# EAGLE design iotssb (EAGLE 9.2.2)

## Sheet 1 of 7
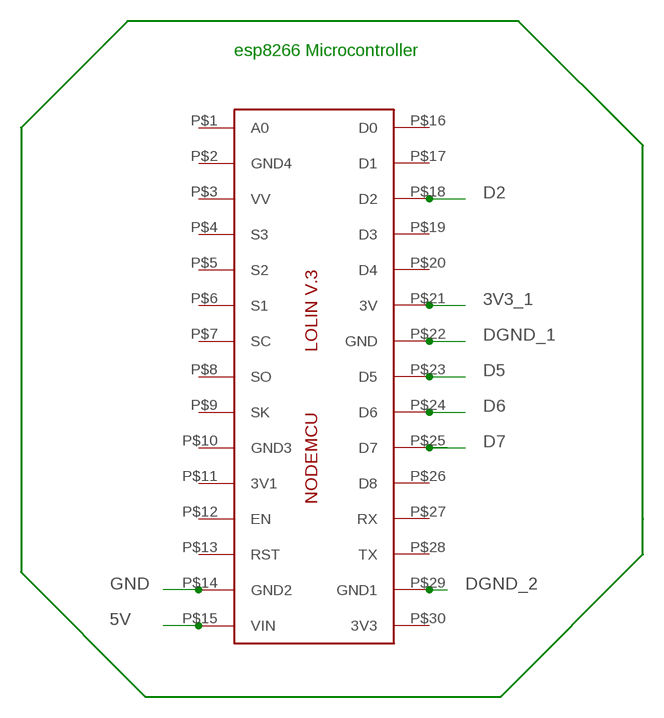
[diagram p0: schematic, sheet 1]

### Parts
IC2  LOLINV3ESP12E  [LOL1NV0.1]

### Nets
3V3_1: IC2.P$21(3V) ; also sheet 2
5V: IC2.P$15(VIN) ; also sheet 3
D2: IC2.P$18(D2) ; also sheet 2
D5: IC2.P$23(D5) ; also sheet 4
D6: IC2.P$24(D6) ; also sheet 5
D7: IC2.P$25(D7) ; also sheet 6
DGND_1: IC2.P$22(GND) ; also sheet 2
DGND_2: IC2.P$29(GND1) ; also sheet 4,5,6
GND: IC2.P$14(GND2) ; also sheet 2,3
Unconnected: IC2.P$1(A0) IC2.P$2(GND4) IC2.P$3(VV) IC2.P$4(S3) IC2.P$5(S2) IC2.P$6(S1) IC2.P$7(SC) IC2.P$8(SO) IC2.P$9(SK) IC2.P$10(GND3) IC2.P$11(3V1) IC2.P$12(EN) IC2.P$13(RST) IC2.P$16(D0) IC2.P$17(D1) IC2.P$19(D3) IC2.P$20(D4) IC2.P$26(D8) IC2.P$27(RX) IC2.P$28(TX) IC2.P$30(3V3)

### Notes on the sheet
- esp8266 Microcontroller

## Sheet 2 of 7
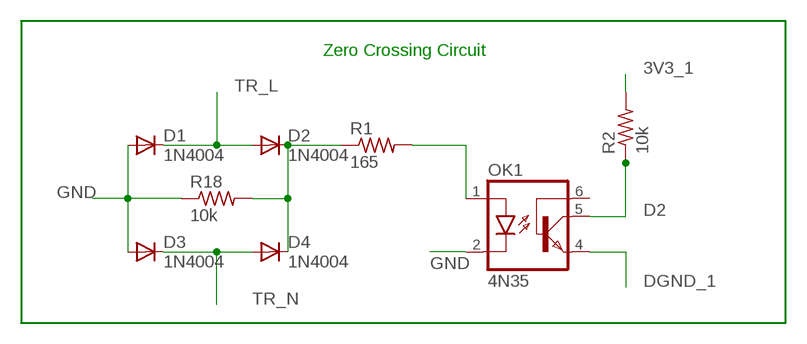
[diagram p1: schematic, sheet 2]

### Parts
D1  1N4004  [DO41-10]
D2  1N4004  [DO41-10]
D3  1N4004  [DO41-10]
D4  1N4004  [DO41-10]
OK1  4N35  [DIL06]
R1  165  R-US_0207/10  [0207/10]
R2  10k  R-US_0207/10  [0207/10]
R18  10k  R-US_0207/10  [0207/10]

### Nets
3V3_1: R2.2 ; also sheet 1
D2: OK1.5(COL) R2.1 ; also sheet 1
DGND_1: OK1.4(EMI) ; also sheet 1
GND: D1.A D3.A OK1.2(C) R18.1 ; also sheet 1,3
N$1: D2.C D4.C R1.1 R18.2
N$5: OK1.1(A) R1.2
TR_L: D1.C D2.A ; also sheet 3,7
TR_N: D3.C D4.A ; also sheet 3,7
Unconnected: OK1.6(BAS)

### Notes on the sheet
- Zero Crossing Circuit

## Sheet 3 of 7
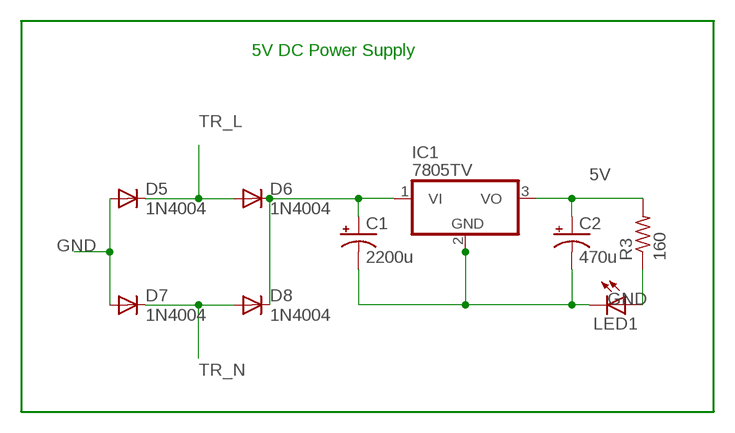
[diagram p2: schematic, sheet 3]

### Parts
C1  2200u  CPOL-USE7.5-18  [E7,5-18]
C2  470u  CPOL-USE5-13  [E5-13]
D5  1N4004  [DO41-10]
D6  1N4004  [DO41-10]
D7  1N4004  [DO41-10]
D8  1N4004  [DO41-10]
IC1  7805TV  [TO220V]
LED1  LED3MM  [LED3MM]
R3  160  R-US_0207/10  [0207/10]

### Nets
5V: C2.+ IC1.3(VO) R3.2 ; also sheet 1
GND: C1.- C2.- D5.A D7.A IC1.2(GND) LED1.K(C) ; also sheet 1,2
N$2: C1.+ D6.C D8.C IC1.1(VI)
N$3: LED1.A R3.1
TR_L: D5.C D6.A ; also sheet 2,7
TR_N: D7.C D8.A ; also sheet 2,7

### Notes on the sheet
- 5V DC Power Supply

## Sheet 4 of 7
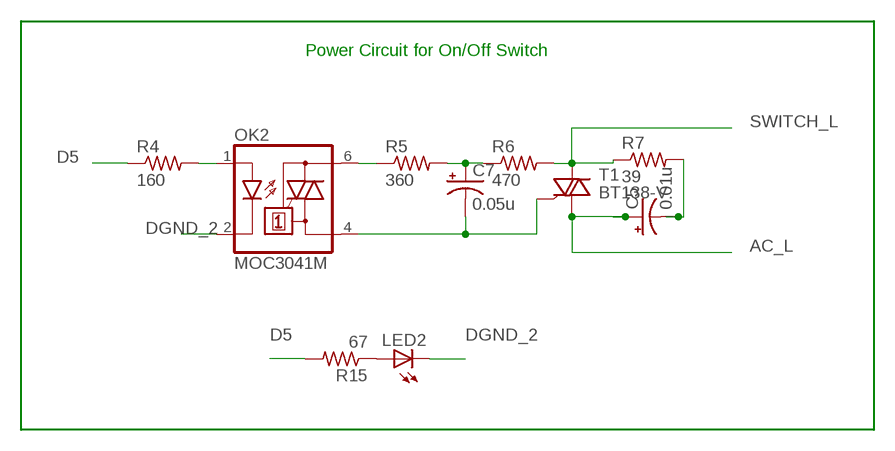
[diagram p3: schematic, sheet 4]

### Parts
C5  0.01u  CPOL-USE5-13  [E5-13]
C7  0.05u  CPOL-USE5-13  [E5-13]
LED2  LED3MM  [LED3MM]
OK2  MOC3041M  [DIL06]
R4  160  R-US_0207/10  [0207/10]
R5  360  R-US_0207/15  [0207/15]
R6  470  R-US_0207/15  [0207/15]
R7  39  R-US_0207/15  [0207/15]
R15  67  R-US_0207/10  [0207/10]
T1  BT138-V  [TO220BV]

### Nets
AC_L: C5.+ T1.T1(A1) ; also sheet 5,6,7
D5: R4.1 R15.2 ; also sheet 1
DGND_2: LED2.K(C) OK2.2(C) ; also sheet 1,5,6
N$4: OK2.6(A2) R5.1
N$6: C7.- OK2.4(A1) T1.G
N$7: OK2.1(A) R4.2
N$8: C7.+ R5.2 R6.1
N$11: C5.- R7.2
N$19: LED2.A R15.1
SWITCH_L: R6.2 R7.1 T1.T2(A2) ; also sheet 7

### Notes on the sheet
- Power Circuit for On/Off Switch

## Sheet 5 of 7
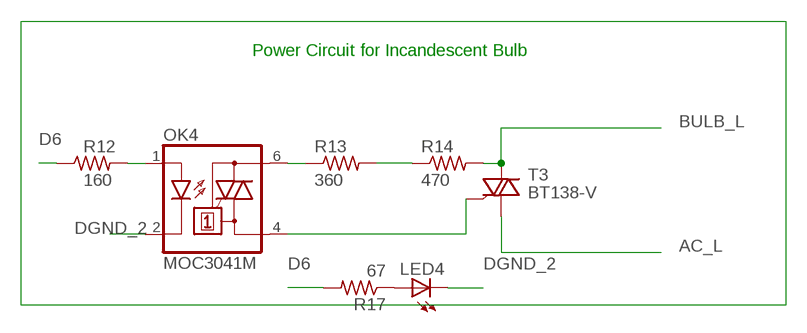
[diagram p4: schematic, sheet 5]

### Parts
LED4  LED3MM  [LED3MM]
OK4  MOC3041M  [DIL06]
R12  160  R-US_0207/10  [0207/10]
R13  360  R-US_0207/15  [0207/15]
R14  470  R-US_0207/15  [0207/15]
R17  67  R-US_0207/10  [0207/10]
T3  BT138-V  [TO220BV]

### Nets
AC_L: T3.T1(A1) ; also sheet 4,6,7
BULB_L: R14.2 T3.T2(A2) ; also sheet 7
D6: R12.1 R17.2 ; also sheet 1
DGND_2: LED4.K(C) OK4.2(C) ; also sheet 1,4,6
N$15: OK4.4(A1) T3.G
N$16: OK4.1(A) R12.2
N$17: OK4.6(A2) R13.1
N$18: R13.2 R14.1
N$22: LED4.A R17.1

### Notes on the sheet
- Power Circuit for Incandescent Bulb

## Sheet 6 of 7
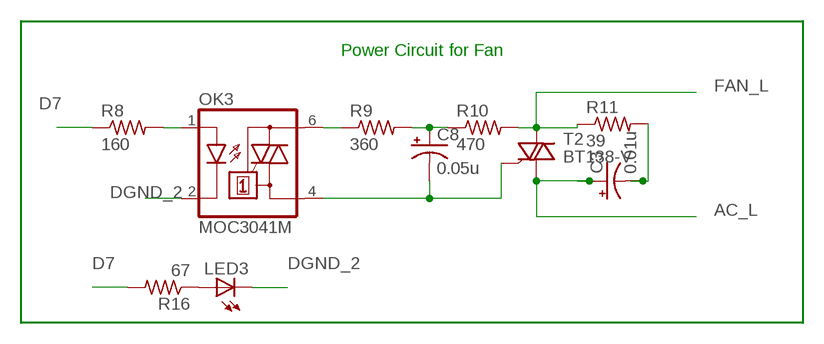
[diagram p5: schematic, sheet 6]

### Parts
C3  0.01u  CPOL-USE5-13  [E5-13]
C8  0.05u  CPOL-USE5-13  [E5-13]
LED3  LED3MM  [LED3MM]
OK3  MOC3041M  [DIL06]
R8  160  R-US_0207/10  [0207/10]
R9  360  R-US_0207/15  [0207/15]
R10  470  R-US_0207/15  [0207/15]
R11  39  R-US_0207/15  [0207/15]
R16  67  R-US_0207/10  [0207/10]
T2  BT138-V  [TO220BV]

### Nets
AC_L: C3.+ T2.T1(A1) ; also sheet 4,5,7
D7: R8.1 R16.2 ; also sheet 1
DGND_2: LED3.K(C) OK3.2(C) ; also sheet 1,4,5
FAN_L: R10.2 R11.1 T2.T2(A2) ; also sheet 7
N$9: C8.- OK3.4(A1) T2.G
N$10: OK3.1(A) R8.2
N$12: OK3.6(A2) R9.1
N$13: C8.+ R9.2 R10.1
N$14: C3.- R11.2
N$21: LED3.A R16.1

### Notes on the sheet
- Power Circuit for Fan

## Sheet 7 of 7
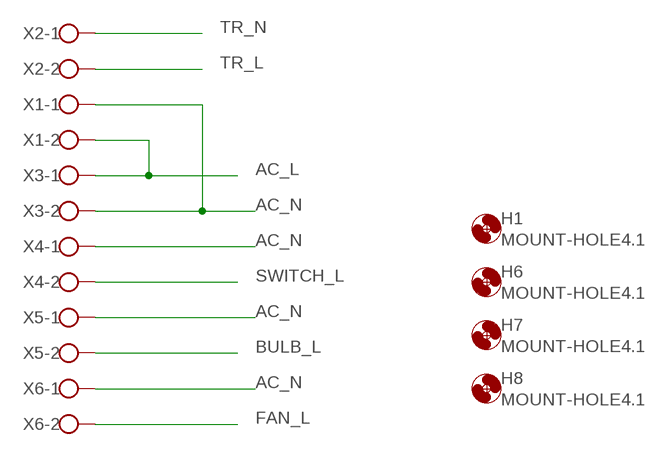
[diagram p6: schematic, sheet 7]

### Parts
H1  MOUNT-HOLE4.1  [4,1]
H6  MOUNT-HOLE4.1  [4,1]
H7  MOUNT-HOLE4.1  [4,1]
H8  MOUNT-HOLE4.1  [4,1]
X1  W237-102  [W237-102]
X2  W237-102  [W237-102]
X3  W237-102  [W237-102]
X4  W237-102  [W237-102]
X5  W237-102  [W237-102]
X6  W237-102  [W237-102]

### Nets
AC_L: X1.2 X3.1 ; also sheet 4,5,6
AC_N: X1.1 X3.2 X4.1 X5.1 X6.1
BULB_L: X5.2 ; also sheet 5
FAN_L: X6.2 ; also sheet 6
SWITCH_L: X4.2 ; also sheet 4
TR_L: X2.2 ; also sheet 2,3
TR_N: X2.1 ; also sheet 2,3

## Library data of the parts
C1 = adafruit:CPOL-US: POLARIZED CAPACITOR, American symbol
C2 C3 C5 C7 C8 = rcl:CPOL-US: POLARIZED CAPACITOR, American symbol; SPICEPREFIX: C
D1-D8 = adafruit:1N4004: DIODE General purpose 1N400x type rectifier (With bigger pads) http://www.ladyada.net/library/pcb/eaglelibrary.html
H1 H6-H8 = holes:MOUNT-HOLE: MOUNTING HOLE with drill center marker
IC1 = linear:78*: Positive VOLTAGE REGULATOR Source: http://cache.national.com/ds/LM/LM78L05.pdf http://www.fairchildsemi.com/ds/LM/LM7805.pdf
IC2 = Lolin:LOLINV3
LED1-LED4 = adafruit:LED: LED OSRAM: - CHIPLED LG R971, LG N971, LY N971, LG Q971, LY Q971, LO R971, LY R971 LH N974, LH R974 LS Q976, LO Q976, LY Q976 LO Q996 - Hyper CHIPLED LW Q18S LB Q993, LB Q99A, LB R99A - SideLED LS A670, LO A670, LY A670, LG A670, LP A670 LB A673, LV A673, LT A673, LW A673 LH A674 LY A675 LS A676, LA A676, LO A676, LY A676, LW A676 LS A679, LY A679, LG A679 - Hyper Micro SIDELED® LS Y876, LA Y876, LO Y876, LY Y876 LT Y87S - SmartLED LW L88C, LW L88S LB L89C, LB L89S, LG L890 LS L89K, LO L89K, LY L89K LS L896, LA L896, LO L896, LY L896 - TOPLED LS T670, LO T670, LY T670, LG T670, LP T670 LSG T670, LSP T670, LSY T670, LOP T670, LYG T670 LG T671, LOG T671, LSG T671 LB T673, LV T673, LT T673, LW T673 LH T674 LS T676, LA T676, LO T676, LY T676, LB T676, LH T676, LSB T676, LW T676 LB T67C, LV T67C, LT T67C, LS T67K, LO T67K, LY T67K, LW E67C LS E67B, LA E67B, LO E67B, LY E67B, LB E67C, LV E67C, LT E67C LW T67C LS T679, LY T679, LG T679 LS T770, LO T770, LY T770, LG T770, LP T770 LB T773, LV T773, LT T773, LW T773 LH T774 LS E675, LA E675, LY E675, LS T675 LS T776, LA T776, LO T776, LY T776, LB T776 LHGB T686 LT T68C, LB T68C - Hyper Mini TOPLED® LB M676 - Mini TOPLED Santana® LG M470 LS M47K, LO M47K, LY M47K Source: http://www.osram.convergy.de/
OK1 = optocoupler:4N35: MOTOROLA OPTO COUPLER; MF: FAIRCHILD SEMICONDUCTOR; MPN: 4N35; OC_FARNELL: 1328375; OC_NEWARK: 72K9946
OK2-OK4 = optocoupler:MOC30*: 6-Pin DIP Zero-Cross Optoisolators Triac Driver Output (250/400 Volt Peak) Source: Data sheet <http://www.fairchildsemi.com/ds/MO/MOC3031M.pdf> The old path of data sheet not more available 2013-05-06.; MF: FAIRCHILD SEMICONDUCTOR; MPN: MOC3041M; OC_FARNELL: 1086677; OC_NEWARK: 78K6090
R1-R18 = adafruit:R-US_: RESISTOR, American symbol
T1-T3 = triac:BT138: TRIAC Source: http://www.semiconductors.philips.com BT138_SERIES_2.pdf
X1-X6 = con-wago-500:W237-102: WAGO SCREW CLAMP; MPN: 237-102; OC_FARNELL: unknown; OC_NEWARK: 70K9898

## Board
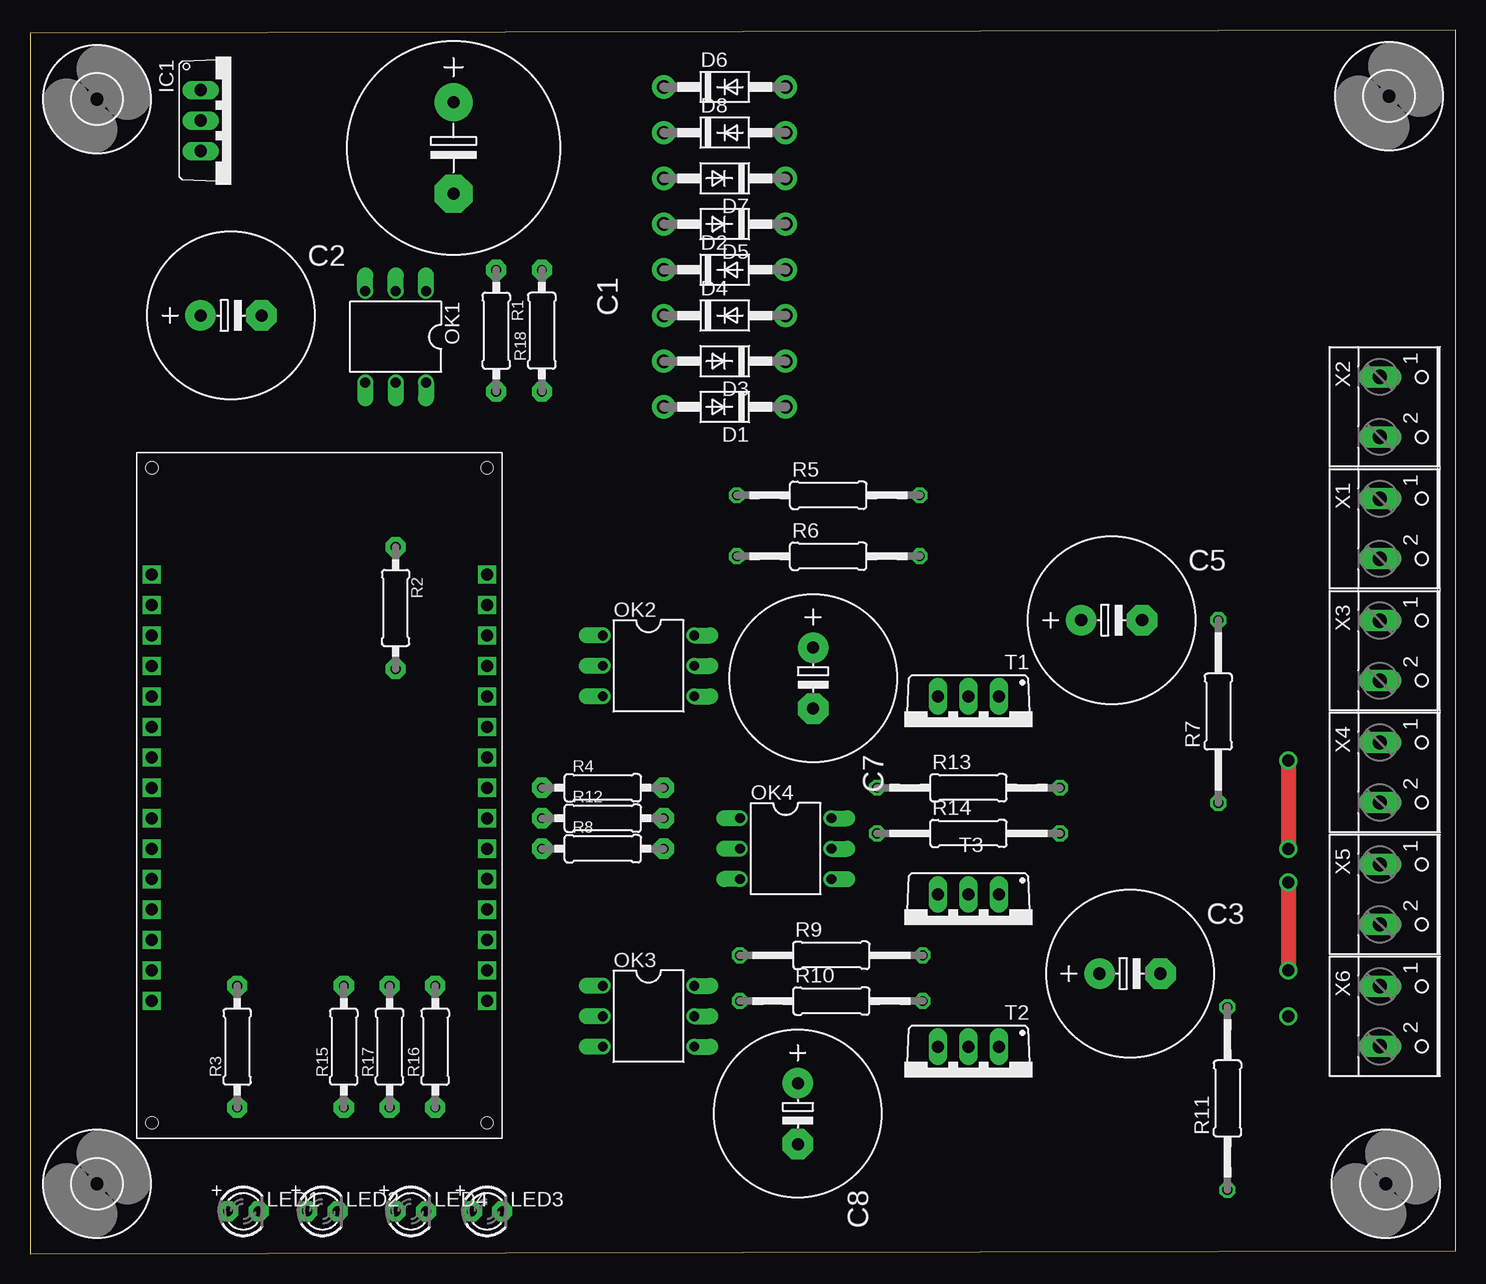
[diagram p7: board, top side]
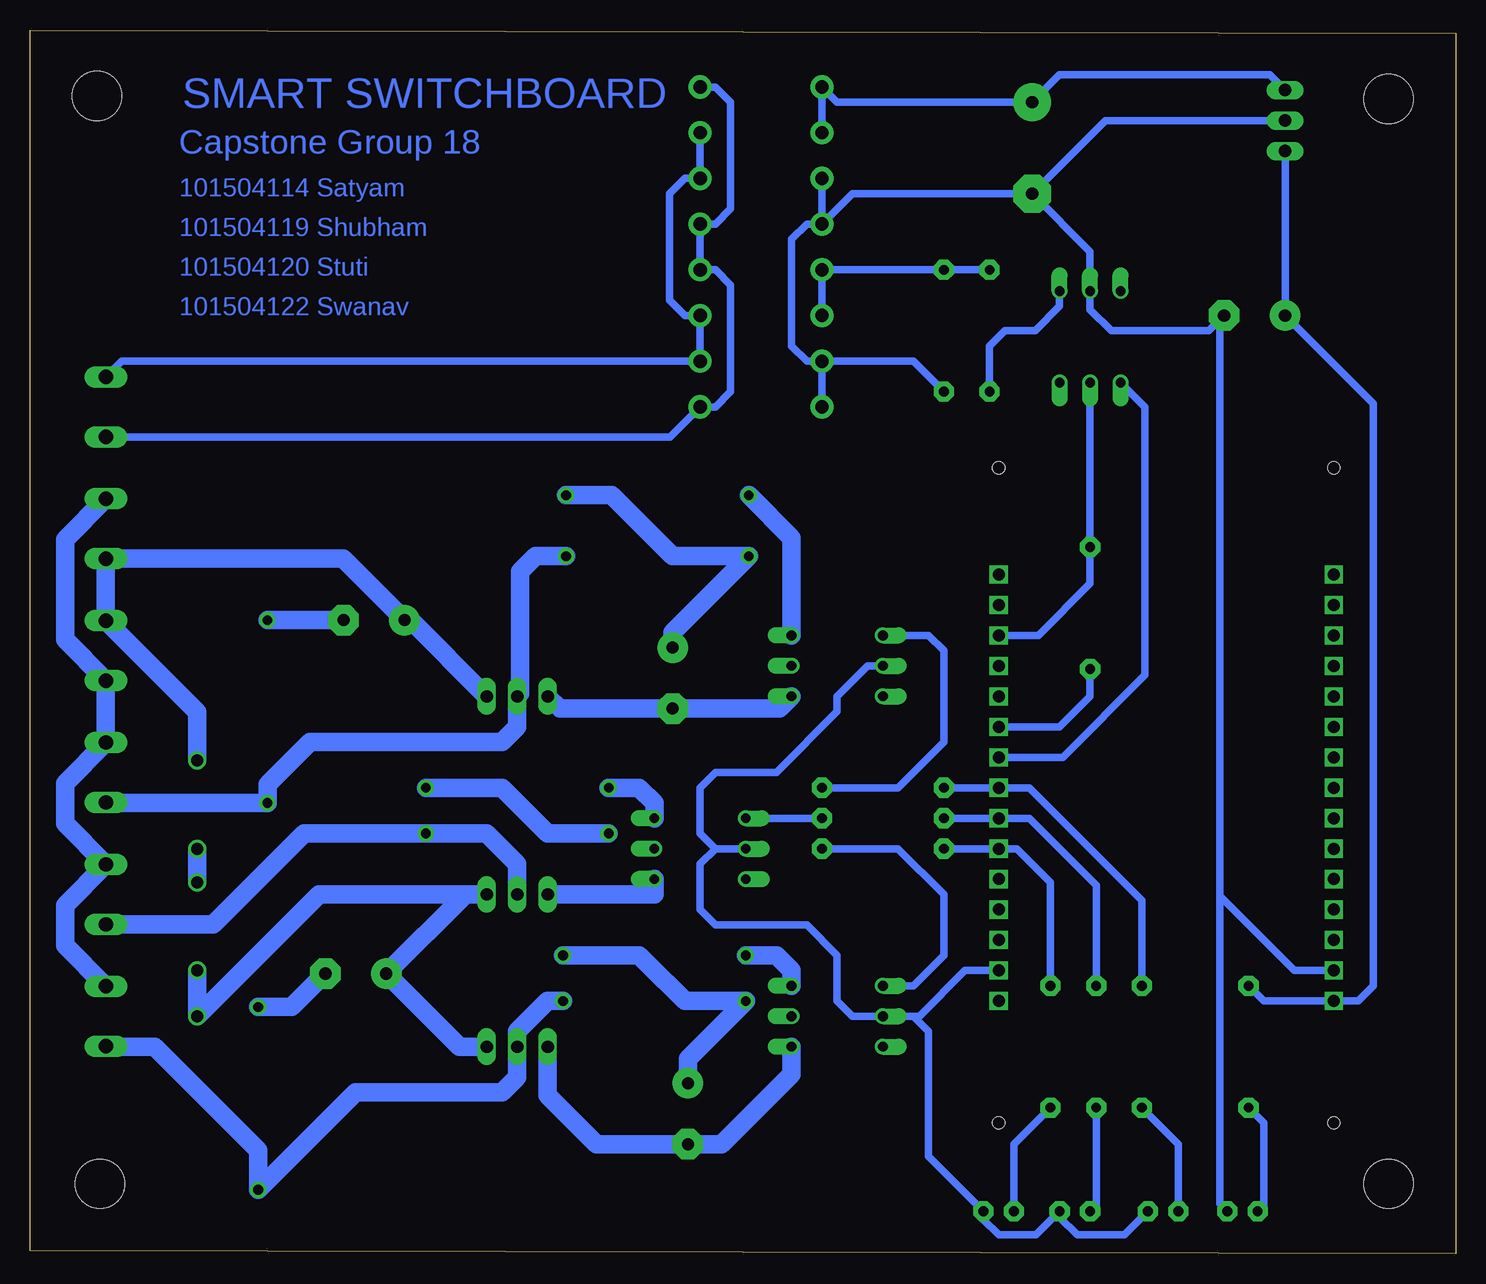
[diagram p8: board, bottom side, seen from below]

Size 118.85 x 102.03 mm. Coordinates in mm from the lower left corner, seen from the top.
Outline: 0,0 118.85,0.25 118.85,102.03 0,101.78 0,0
Copper layers (1*16): Top 0.035mm / dielectric 1.5mm / Bottom 0.035mm
Design rules "default": minimum track width 6mil, minimum drill 0.35mm, track to track 6mil, track to pad 6mil, pad to pad 6mil, via to via 6mil, smd to smd 6mil, copper to edge 40mil, drill to drill 6mil, minimum pad ring 10mil, minimum via ring 8mil, stop-mask expansion 4mil, vias tented up to drill 0mil, thermal gap 10mil

### Footprints (pad centres in the part's own frame; a part is rotated, then mirrored left to right if it is on the bottom)
E7,5-18 = drill 1.016 pad 3.15: + -3.81,0 | drill 1.016 pad 3.15 octagon: - 3.81,0
E5-13 = drill 1.016 pad 2.54: + -2.54,0 | drill 1.016 pad 2.54 octagon: - 2.54,0
DO41-10 = drill 1.118 pad 1.93: A 5.08,0; C -5.08,0
4,1 = hole 4.1: 0,0
TO220V = drill 1.016 long: 1 -2.54,-2.54; 2 0,-2.54; 3 2.54,-2.54
LOL1NV0.1 = drill 1 square: P$1 0,0; P$2 2.54,0; P$3 5.08,0; P$4 7.62,0; P$5 10.16,0; P$6 12.7,0; P$7 15.24,0; P$8 17.78,0; P$9 20.32,0; P$10 22.86,0; P$11 25.4,0; P$12 27.94,0; P$13 30.48,0; P$14 33.02,0; P$15 35.56,0; P$16 0,27.94; P$17 2.54,27.94; P$18 5.08,27.94; P$19 7.62,27.94; P$20 10.16,27.94; P$21 12.7,27.94; P$22 15.24,27.94; P$23 17.78,27.94; P$24 20.32,27.94; P$25 22.86,27.94; P$26 25.4,27.94; P$27 27.94,27.94; P$28 30.48,27.94; P$29 33.02,27.94; P$30 35.56,27.94 | hole 1: -8.89,27.94; 45.72,27.94; 45.72,0; -8.89,0
LED3MM = drill 0.813 pad 1.676 octagon: A -1.27,0; K 1.27,0
DIL06 = drill 0.813 offset: 1 -2.54,-3.81; 2 0,-3.81; 3 2.54,-3.81; 4 2.54,3.81; 5 0,3.81; 6 -2.54,3.81
0207/10 = drill 0.813 pad 1.676 octagon: 1 -5.08,0; 2 5.08,0
0207/15 = drill 0.813 octagon: 1 -7.62,0; 2 7.62,0
TO220BV = drill 1.016 long: G 2.54,-2.54; T1 -2.54,-2.54; T2 0,-2.54
W237-102 = drill 1.194 long: 1 -2.5,-1.27; 2 2.5,-1.27

### Placement (x,y rotation side)
C1  35.31,92.2 270 top
C2  16.76,78.23 0 top
C3  91.69,23.37 0 top
C5  90.17,52.83 0 top
C7  65.28,48.01 270 top
C8  64.01,11.68 270 top
D1  57.91,70.61 180 top
D2  57.91,82.04 0 top
D3  57.91,74.42 180 top
D4  57.91,78.23 0 top
D5  57.91,85.85 180 top
D6  57.91,97.28 0 top
D7  57.91,89.66 180 top
D8  57.91,93.47 0 top
H1  113.03,5.84 0 top
H6  5.59,5.84 0 top
H7  113.28,96.52 0 top
H8  5.59,96.27 0 top
IC1  16.76,94.49 270 top
IC2  10.16,56.64 270 top
LED1  17.78,3.56 0 top
LED2  24.38,3.56 0 top
LED3  38.1,3.56 0 top
LED4  31.75,3.56 0 top
OK1  30.48,76.45 180 top
OK2  51.56,49.02 270 top
OK3  51.56,19.81 270 top
OK4  62.99,33.78 270 top
R1  38.86,76.96 270 top
R2  30.48,53.85 270 top
R3  17.27,17.27 90 top
R4  47.75,38.86 0 top
R5  66.55,63.25 0 top
R6  66.55,58.17 0 top
R7  99.06,45.21 90 top
R8  47.75,33.78 0 top
R9  66.8,24.89 0 top
R10  66.8,21.08 0 top
R11  99.82,12.95 90 top
R12  47.75,36.32 0 top
R13  78.23,38.86 0 top
R14  78.23,35.05 0 top
R15  26.16,17.27 90 top
R16  33.78,17.27 90 top
R17  29.97,17.27 90 top
R18  42.67,76.96 90 top
T1  78.23,43.94 180 top
T2  78.23,14.73 180 top
T3  78.23,27.43 180 top
X1  113.79,60.45 270 top
X2  113.79,70.61 270 top
X3  113.79,50.29 270 top
X4  113.79,40.13 270 top
X5  113.79,29.97 270 top
X6  113.79,19.81 270 top

### Tracks (layer width: path | path; a pad name or v marks a point on that pad's centre or on a via)
3V3_1
  Bottom 0.61: R2.2 30.48,46.48 33.02,43.94 IC2.P$21
5V
  Bottom 0.61: C2.+ 6.86,70.87 6.86,22.35 8.13,21.08 IC2.P$15 16,21.08 R3.2 | 14.22,79.5 C2.+ | IC1.3 C2.+
AC_L  (via drill 1)
  Top 1.27: v104.9,41.15 v104.9,33.78 | v104.9,30.99 v104.9,23.62
  Bottom 1.524: v104.9,33.78 v104.9,30.99 | v104.9,23.62 v104.9,19.81 94.74,29.97 T3.T1 82.55,29.97 C3.+ 83.06,17.27 T2.T1 | v104.9,41.15 104.9,45.17 X3.1 X1.2 92.75,57.95 C5.+ 87.12,52.83 T1.T1
AC_N
  Bottom 1.524: X1.1 115.93,59.54 115.93,58.17 115.93,51.2 X3.2 X4.1 115.93,39.22 115.93,35.88 X5.1 115.93,29.06 115.93,27.43 115.93,25.72 X6.1
BULB_L
  Bottom 1.524: T3.T2 78.23,32.51 80.77,35.05 R14.2 87.12,35.05 96.01,35.05 103.59,27.47 X5.2
D2
  Bottom 0.61: OK1.5 R2.1 30.48,55.88 34.8,51.56 IC2.P$18
D5
  Bottom 0.61: 35.56,38.86 IC2.P$23 R4.1 | 35.56,38.86 26.16,29.46 | 26.16,29.46 35.56,38.86 | R15.2 26.16,29.46
D6
  Bottom 0.61: R17.2 29.97,30.73 35.56,36.32 IC2.P$24 R12.1
D7
  Bottom 0.61: R16.2 33.78,30.99 36.58,33.78 IC2.P$25 R8.1
DGND_1
  Bottom 0.61: OK1.4 25.91,70.61 25.91,48.26 32.77,41.4 IC2.P$22
DGND_2
  Bottom 0.61: 57.91,33.78 OK4.2 61.72,33.78 | OK2.2 49.02,49.02 51.56,46.48 51.56,45.21 56.64,40.13 61.72,40.13 62.99,38.86 62.99,35.05 61.72,33.78 | OK3.2 45.21,19.81 43.94,18.54 43.94,8.13 LED3.K 39.37,2.84 38.1,1.57 35,1.57 LED4.K 33.02,3.05 31.55,1.57 27.64,1.57 LED2.K | OK3.2 50.29,19.81 51.56,21.08 51.56,24.89 54.1,27.43 61.72,27.43 62.99,28.7 62.99,32.51 61.72,33.78 | IC2.P$29 40.89,23.62 44.7,19.81 OK3.2
FAN_L
  Bottom 1.524: R10.2 75.69,21.08 78.23,18.54 T2.T2 78.23,14.73 79.5,13.46 81.79,13.46 | 89.66,13.46 81.79,13.46 | X6.2 112.52,17.27 108.46,17.27 99.82,8.64 R11.1 91.69,13.46 81.79,13.46
GND
  Bottom 0.61: C2.- 19.69,77.85 | 19.69,77.85 20.57,76.96 28.7,76.96 30.48,78.74 OK1.2 30.48,83.57 C1.- | R18.1 45.21,74.42 D3.A | D1.A D3.A | D7.A D5.A | D5.A 54.1,85.85 55.37,84.58 55.37,75.69 54.1,74.42 D3.A | C1.- 50.29,88.39 D5.A | IC1.2 29.21,94.49 C1.- | 19.69,29.84 19.69,4.19 LED1.K | IC2.P$14 13.46,23.62 19.69,29.84 | 19.69,29.84 19.69,77.85
N$1
  Bottom 0.61: D2.C R18.2 R1.1 D2.C | D4.C D2.C
N$2
  Bottom 0.61: D8.C D6.C 51.56,96.01 C1.+ 33.02,98.3 15.49,98.3 IC1.1
N$3
  Bottom 0.61: R3.1 16,10.92 16,4.06 LED1.A
N$4
  Bottom 1.524: R5.1 55.37,59.69 OK2.6
N$5
  Bottom 0.61: OK1.1 33.02,78.99 35.05,76.96 37.59,76.96 38.86,75.69 R1.2
N$6
  Bottom 1.524: OK2.4 56.39,45.47 C7.- 74.68,45.47 T1.G
N$7
  Bottom 0.61: OK2.1 43.94,51.56 42.67,50.29 42.67,42.67 46.48,38.86 R4.2
N$8
  Bottom 1.524: R5.2 70.36,63.25 65.28,58.17 R6.1 65.28,51.82 C7.+
N$9
  Bottom 1.524: OK3.4 55.37,14.99 61.21,9.14 C8.- 71.63,9.14 75.69,13.21 T2.G
N$10
  Bottom 0.61: R8.2 46.48,33.78 42.67,29.97 42.67,24.89 45.21,22.35 OK3.1
N$11
  Bottom 1.524: C5.- R7.2
N$12
  Bottom 1.524: OK3.6 55.37,23.62 56.64,24.89 R9.1
N$13
  Bottom 1.524: R9.2 68.07,24.89 67.44,24.26 64.26,21.08 R10.1 64.01,16.26 C8.+
N$14
  Bottom 1.524: C3.- 97.03,20.57 R11.2
N$15
  Bottom 1.524: OK4.4 66.8,29.97 T3.G
N$16
  Bottom 0.61: OK4.1 R12.2
N$17
  Bottom 1.524: 69.34,38.86 R13.1 68.07,38.86 66.8,37.59 OK4.6
N$18
  Bottom 1.524: R14.1 75.69,35.05 79.5,38.86 R13.2
N$19
  Bottom 0.61: LED2.A 23.11,9.14 R15.1
N$21
  Bottom 0.61: LED3.A 36.83,9.14 R16.1
N$22
  Bottom 0.61: R17.1 29.97,4.06 LED4.A
SWITCH_L
  Bottom 1.524: R6.2 76.71,58.17 77.98,56.9 77.98,46.74 T1.T2 78.23,43.94 79.5,42.67 95.5,42.67 99.06,39.12 R7.1 112.48,37.59 X4.2
TR_L
  Bottom 0.61: D6.A 61.72,97.28 60.45,96.01 60.45,87.12 61.72,85.85 D5.C D2.A 61.72,82.04 60.45,80.77 60.45,71.88 61.72,70.61 D1.C 65.49,68.11 X2.2
TR_N
  Bottom 0.61: D8.A D7.C 64.26,89.66 65.53,88.39 65.53,79.5 64.26,78.23 D4.A D3.C 111.21,74.42 X2.1

### Text on the board
Bottom: SMART SWITCHBOARD | Capstone Group 18 | 101504114 Satyam | 101504119 Shubham | 101504120 Stuti | 101504122 Swanav